# Altium schematic sheet Power.SchDoc
size 420 x 297 mm
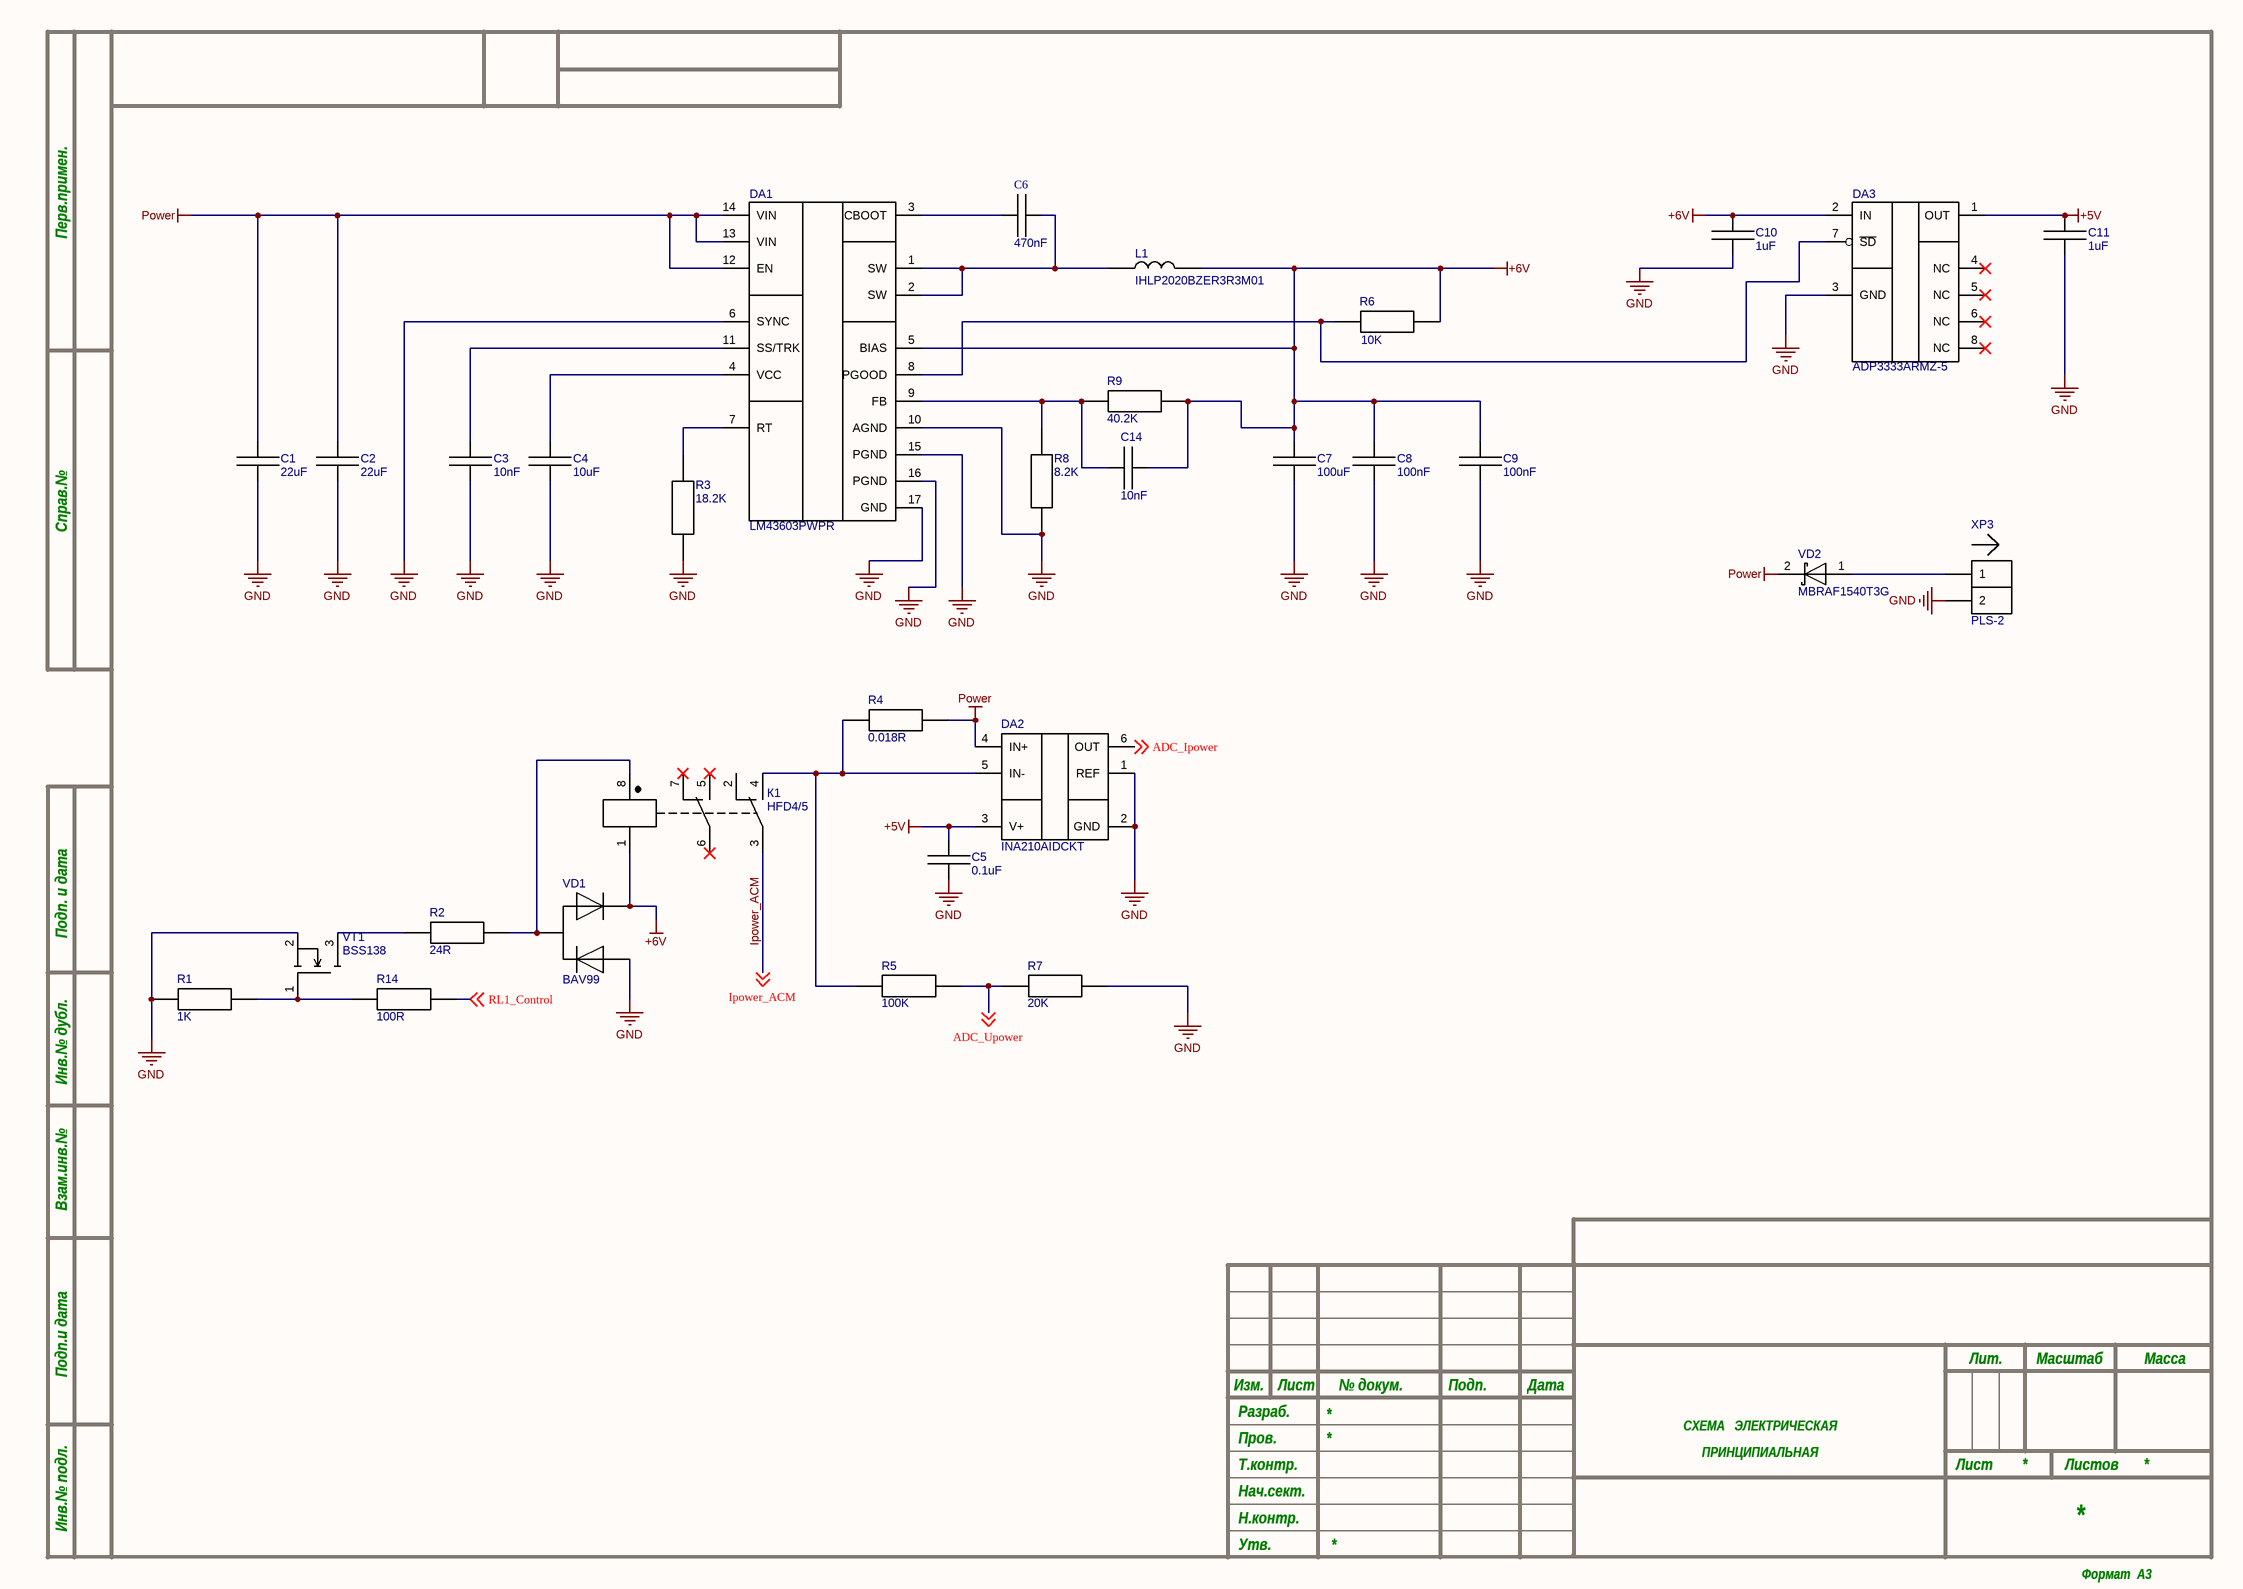
[diagram p0: Power.SchDoc]

## Parts
C1  22uF  [1210C]
C2  22uF  [1210C]
C3  10nF  [0402C]
C4  10uF  [0402C]
C5  0.1uF  [0603C]
C6  470nF  [0402C]
C7  100uF  [1210C]
C8  100nF  [0402C]
C9  100nF  [0402C]
C10  1uF  [0603C]
C11  1uF  [0603C]
C14  10nF  [0402C]
DA1  LM43603PWPR  [TSSOP-17]
DA2  INA210AIDCKT  [SC-70-6]
DA3  ADP3333ARMZ-5  [MSOP-8]
L1  IHLP2020BZER3R3M01  [IHLP2020CZ-01]
R1  1K  [R0402]
R2  24R  [R0402]
R3  18.2K  [R0402]
R4  0.018R  [R1206]
R5  100K  [R0402]
R6  10K  [R0402]
R7  20K  [R0402]
R8  8.2K  [R0402]
R9  40.2K  [R0402]
R14  100R  [R0402]
VD1  BAV99  [SOT-23-3]
VD2  MBRAF1540T3G  [SMA-FL]
VT1  BSS138  [SOT-23-3]
XP3  PLS-2  [PLS-2]
К1  HFD4/5  [DIP-8]

## Nets
+5V: C5.2 C11.2 DA2.3(V+) DA3.1(OUT)
+6V: C7.2 C8.2 C9.2 C10.2 C14.2 DA1.5(BIAS) DA3.2(IN) L1.2 R6.2 R9.2 VD1.2 К1.1
GND: C1.1 C2.1 C3.1 C4.1 C5.1 C7.1 C8.1 C9.1 C10.1 C11.1 DA1.6(SYNC) DA1.10(AGND) DA1.15(PGND) DA1.16(PGND) DA1.17(GND) DA2.1(REF) DA2.2(GND) DA3.3(GND) R1.1 R3.1 R7.2 R8.1 VD1.1 VT1.2 XP3.2
Power: C1.2 C2.2 DA1.12(EN) DA1.13(VIN) DA1.14(VIN) DA2.4(IN+) R4.1 VD2.2
ADC_Ipower: DA2.6(OUT) ; off-sheet ADC_Ipower
ADC_Upower: R5.2 R7.1 ; off-sheet ADC_Upower
Ipower_ACM: К1.3 ; off-sheet Ipower_ACM
RL1_Control: R14.2 ; off-sheet RL1_Control
NetC3_2: C3.2 DA1.11(SS/TRK)
NetC4_2: C4.2 DA1.4(VCC)
NetC6_1: C6.1 DA1.3(CBOOT)
NetC6_2: C6.2 DA1.1(SW) DA1.2(SW) L1.1
NetC14_1: C14.1 DA1.9(FB) R8.2 R9.1
NetDA1_7: DA1.7(RT) R3.2
NetDA1_8: DA1.8(PGOOD) DA3.7(~{SD}) R6.1
NetDA2_5: DA2.5(IN-) R4.2 R5.1 К1.4
NetR1_2: R1.2 R14.1 VT1.1
NetR2_1: R2.1 VT1.3
NetR2_2: R2.2 VD1.3 К1.8
NetVD2_1: VD2.1 XP3.1

Not connected (* = marked no-connect by the designer): DA3 4(NC)* 5(NC)* 6(NC)* 8(NC)*; К1 2 5* 6* 7*

## Notes on the sheet
- Перв.примен.
- Справ.№
- Подп. и дата
- Инв.№ дубл.
- Взам.инв.№
- Подп.и дата
- Разраб.
- Изм.
- Лист
- № докум.
- Подп.
- Дата
- Лит.
- Масштаб
- Масса
- Т.контр.
- Пров.
- СХЕМА   ЭЛЕКТРИЧЕСКАЯ
- ПРИНЦИПИАЛЬНАЯ
- Листов
- Инв.№ подл.
- Утв.
- Н.контр.
- Нач.сект.
- Формат  A3

## Library data of the parts
C1 C2 = C1210-22uF 10% 50V: Part Number: SMD CAP CER 22uF ±10% 50V X7R 1210; Solder_Amount: 2; Pkg: 1210; MountType: SMD; Mount: MOUNT
C3 C14 = C0402-10nF 10% 50V: Part Number: SMD CAP CER 10nF ±10% 50V X5R 0402; Added_by: Rutel@Mail.ru; Solder_Amount: 2; Pkg: 0402; Created_at: 27/03/2020; MountType: SMD; Mount: MOUNT
C4 = C0402-10UF 10% 10V: Part Number: SMD CAP CER 10UF ±10% 10V X5R 0402; Added_by: Rutel@Mail.ru; Solder_Amount: 2; Pkg: 0402; Created_at: 27/03/2020; MountType: SMD; Mount: MOUNT
C5 = C0603-0.1UF 10% 50V: C0603 0.1UF 10% 50V; Part Number: SMD CAP CER 0.1UF ±10% 50V X7R 0603; Added_by: anton@teslatec.ru; Solder_Amount: 2; Pkg: 0603; Created_at: 10/01/2023; MountType: SMD; Mount: MOUNT
C6 = C0402-470nF 10% 50V: Part Number: SMD CAP CER 470nF ±10% 50V X5R 0402; Solder_Amount: 2; Pkg: 0402; MountType: SMD; Mount: MOUNT
C7 = C1210-100UF 10% 16V: Part Number: SMD CAP CER 100UF ±10% 16V X7R 1210; Solder_Amount: 2; Pkg: 1210; MountType: SMD; Mount: MOUNT
C8 C9 = C0402-100nF 10% 50V: Part Number: SMD CAP CER 100nF ±10% 50V X5R 0402; Added_by: Rutel@Mail.ru; Solder_Amount: 2; Pkg: 0402; Created_at: 27/03/2020; MountType: SMD; Mount: MOUNT
C10 C11 = C0603-1uF 10% 50V: Part Number: SMD CAP CER 1uF ±10% 50V X7R 0603; Added_by: grebelny_av@teslatec.ru; Solder_Amount: 2; Pkg: 0603; Created_at: 22/06/2021; MountType: SMD; Mount: MOUNT
DA1 = LM43603PWPR: LM43603PWPR 3.5-V to 36-V, 3-A Synchronous Step-Down Voltage Converter; Added_by: irdolgopolowa@yandex.ru; Pkg: MSE 16; Solder_Amount: 17; Value: LM43603QWPR; Created_at: 29/10/24; Mount: MOUNT; MountType: SMD; Part Number: LM43603PWPR
DA2 = INA210AIDCKT: 26V, 14kHz, bi-directional, package SC70-6, -40 to 125; Added_by: ridel_av@teslatec.ru; Solder_Amount: 6; Created_at: 02/02/2022; Mount: MOUNT; MountType: SMD; Part Number: INA210AIDCKT; Pkg: SC70-6
DA3 = ADP3333ARMZ-5: 5V 300 mA, Low Dropout, / CMOS Linear Regulator; Added_by: irdolgopolowa@yandex.ru; Pkg: 8-Lead MSOP; Solder_Amount: 8; Created_at: 29/10/24; Mount: MOUNT; MountType: SMD; Part Number: ADP3333ARMZ-5
L1 = IHLP2020BZER3R3M01: FIXED IND 3.3UH 3.3A 79 MOHM SMD; Solder_Amount: 2; Pkg: IHLP-2020BZ-01; Added_by: Rutel@teslatec.ru; Part Number: IHLP2020BZER3R3M01; MountType: SMD; Mount: MOUNT; Created_at: 14/05/2020
R1 = R0402-1K: Resistor SMD 1K 1% 0402; Part Number: SMD RES 1 KOHM 1% ±100ppm/°C 0402; Added_by: irdolgopolowa@yandex.ru; Solder_Amount: 2; Pkg: 0402; Created_at: 29/10/24; MountType: SMD; Mount: MOUNT
R2 = R0402-24R: Resistor SMD 24R 1% 0402; Part Number: SMD RES 24R OHM 1% ±100ppm/°C 0402; Added_by: Rutel@teslatec.ru; Solder_Amount: 2; Pkg: 0402; Created_at: 21/04/2020; MountType: SMD; Mount: MOUNT
R3 = R0402-18.2K: Resistor SMD 18.2K 1% 0402; Part Number: SMD RES 18.2 KOHM 1% ±100ppm/°C 0402; Added_by: Rutel@teslatec.ru; Solder_Amount: 2; Pkg: 0402; Created_at: 21/04/2020; MountType: SMD; Mount: MOUNT
R4 = R1206-0.018R: Resistor SMD 0.018R 1% 1206; Part Number: TL2BR018F SMD RES 0.018 OHM 1% ±75ppm/°C 1206; Added_by: irdolgopolowa@yandex.ru; Solder_Amount: 2; Pkg: 1206; Created_at: 07/11/2024; MountType: SMD; Mount: MOUNT
R5 = R0402-100K: Resistor SMD 100K 1% 0402; Part Number: SMD RES 100 KOHM 1% ±100ppm/°C 0402; Added_by: Rutel@teslatec.ru; Solder_Amount: 2; Pkg: 0402; Created_at: 21/04/2020; MountType: SMD; Mount: MOUNT
R6 = R0402-10K: Resistor SMD 10K 1% 0402; Part Number: SMD RES 10 KOHM 1% ±100ppm/°C 0402; Added_by: Rutel@teslatec.ru; Solder_Amount: 2; Pkg: 0402; Created_at: 21/04/2020; MountType: SMD; Mount: MOUNT
R7 = R0402-20K: Resistor SMD 20K 1% 0402; Part Number: SMD RES 20 KOHM 1% ±100ppm/°C 0402; Added_by: Rutel@teslatec.ru; Solder_Amount: 2; Pkg: 0402; Created_at: 21/04/2020; MountType: SMD; Mount: MOUNT
R8 = R0402-8.2K: Resistor SMD 8.2K 1% 0402; Part Number: SMD RES 8.2 KOHM 1% ±100ppm/°C 0402; Added_by: Rutel@teslatec.ru; Solder_Amount: 2; Pkg: 0402; Created_at: 21/04/2020; MountType: SMD; Mount: MOUNT
R9 = R0402-40.2K: Resistor SMD 40.2K 1% 0402; Part Number: SMD RES 40.2K KOHM 1% ±100ppm/°C 0402; Added_by: ridel_av@teslatec.ru; Solder_Amount: 2; Pkg: 0402; Created_at: 15/12/2021; MountType: SMD; Mount: MOUNT
R14 = R0402-100R: Resistor SMD 100R 1% 0402; Part Number: SMD RES 100 OHM 1% ±100ppm/°C 0402; Added_by: irdolgopolowa@yandex.ru; Solder_Amount: 2; Pkg: 0402; Created_at: 29/10/24; MountType: SMD; Mount: MOUNT
VD1 = BAV99: BAV99, UMW, 70В, 200мА; Added_by: andrew@teslatec.ru; Solder_Amount: 3; Created_at: 29/06/2020; Mount: MOUNT; MountType: SMD; Pkg: SOT-23-3; Part Number: BAV99
VD2 = MBRAF1540T3G: 1.5 A, 40 V Schottky Rectifier; Added_by: irdolgopolowa@yandex.ru; Solder_Amount: 2; Created_at: 29.10.24; Mount: MOUNT; MountType: SMD; Pkg: SMA-FL; Part Number: MBRAF1540T3G
VT1 = BSS138: N-Channel Logic Level Enhancement Mode Field Effect Transistor; Solder_Amount: 3; Added_by: ma_lubushkin@teslatec.ru; Pkg: SOT-23; Part Number: BSS138; Mount: MOUNT; MountType: SMD; Created_at: 03/12/2019
XP3 = PLS-2: HEADER 2.54mm; Added_by: irdolgopolowa@yandex.ru; Solder_Amount: 2; Created_at: 29/10/24; Mount: MOUNT; MountType: THM; Part Number: PLS-2; Pkg: PLS-2
К1 = HFD4/5: HFD4/5 (IM03TS) (1-1462037-8), 5VDC, 2A/250VAC DPDT; Part Number: HFD4/5SR; Added_by: irdolgopolowa@yandex.ru; Solder_Amount: 8; Created_at: 30/10/24; Mount: MOUNT; MountType: THM; Pkg: DIP-8